# Altium schematic sheet Power.SchDoc
size A3
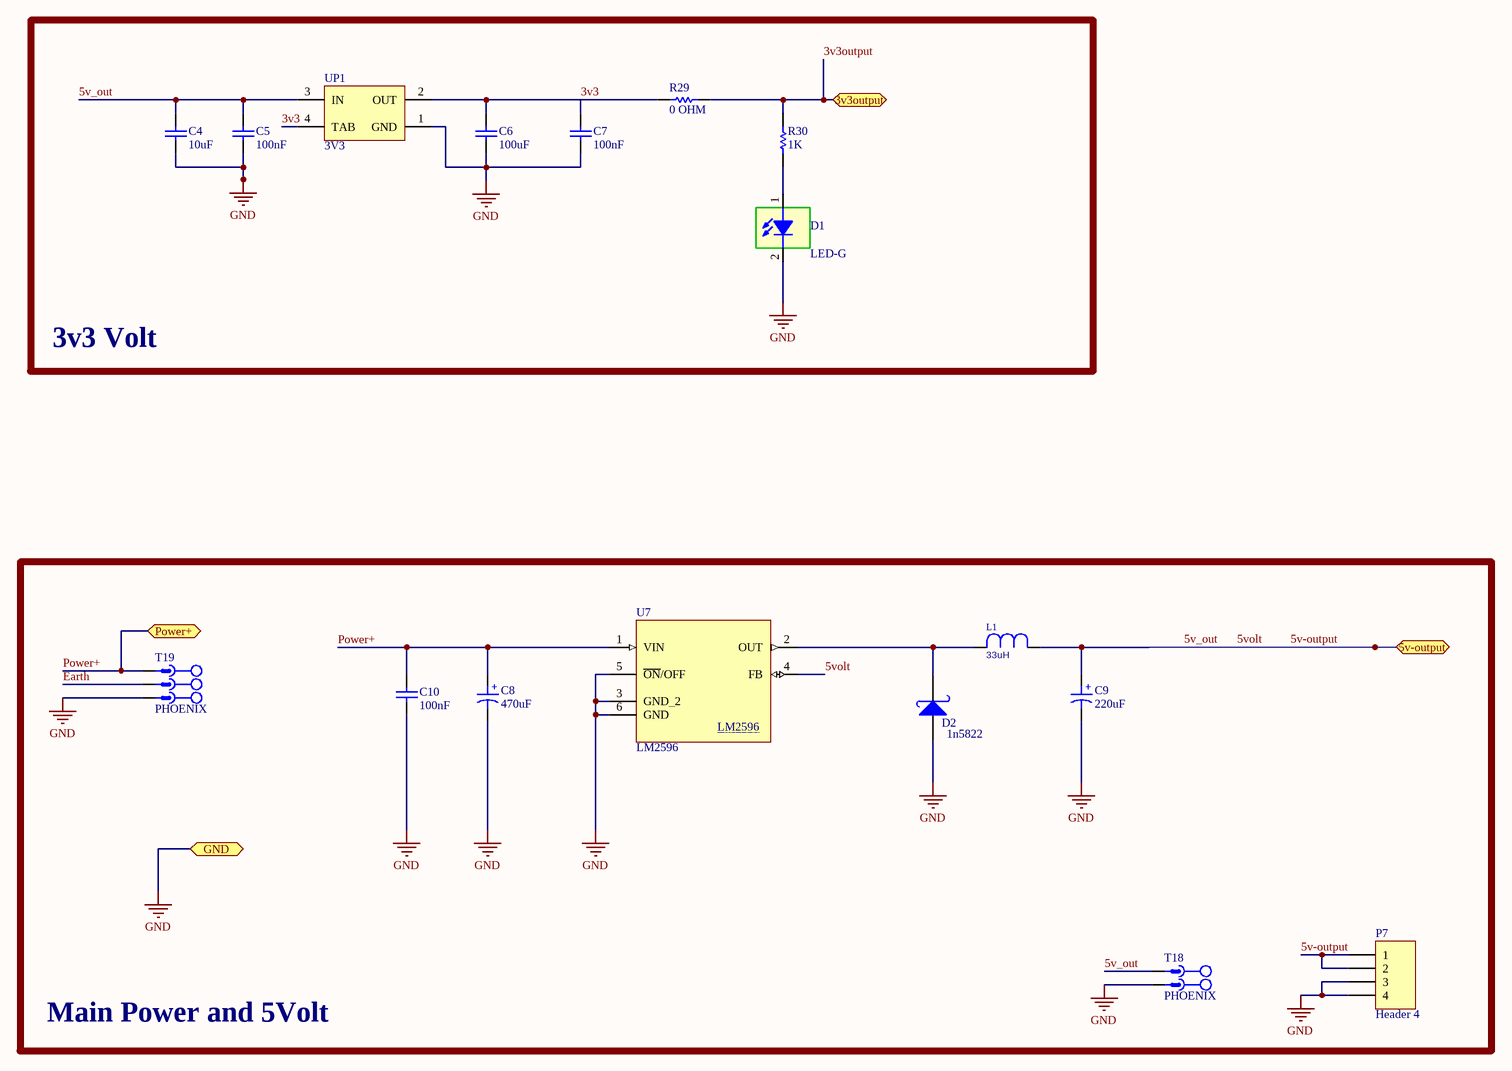
[diagram p0: Power.SchDoc]

## Parts
C4  10uF  [CAPC4817X12N]
C5  100nF  [CAPC3413X12N]
C6  100uF  [CAPC4817X12N]
C7  100nF  [CAPC3413X12N]
C8  470uF  [CAP SMD 470uF]
C9  220uF  [CAP SMD 470uF]
C10  100nF  [CAPC3413X12N]
D1  LED-G  [LED 1206]
D2  1n5822  [DO-214AB(SMC)]
L1  33uH  [CDRH127]
P7  Header 4  [HDR1X4]
R29  0 OHM  [RESC3413X04N]
R30  1K  [RESC3413X04N]
T18  PHOENIX  [MSTB 2,5/2-G-5,08]
T19  PHOENIX  [MSTB 2,5/3-G-5,08]
U7  LM2596  [TO170P1524X483-6N]
UP1  3V3  [SOT223_N]

## Blocks framed on the sheet
3v3 Volt: C4-C7 D1 R29 R30 UP1
Main Power and 5Volt: C8-C10 D2 L1 P7 T18 T19 U7

## Ports
3v3output (bidir), 5v-output (bidir), GND (bidir), Power+ (bidir)

## Nets
GND: C4.1 C5.1 C6.1 C7.1 C8.2 C9.2 C10.1 D1.2 D2.1(A) P7.3 P7.4 T18.1 T19.3 U7.3(GND_2) U7.5(~{ON}/OFF) U7.6(GND) UP1.1(GND) ; port GND
3v3: C6.2 C7.2 R29.1 UP1.2(OUT) UP1.4(TAB)
3v3output: R29.2 R30.2 ; port 3v3output
5v-output: C4.2 C5.2 C9.1 L1.1 P7.1 P7.2 T18.2 U7.4(FB) UP1.3(IN) ; port 5v-output  [also labelled 5v_out, 5volt]
Earth: T19.2
Power+: C8.1 C10.2 T19.1 U7.1(VIN) ; port Power+
NetD1_1: D1.1 R30.1
NetD2_2: D2.2(K) L1.2 U7.2(OUT)

## Notes on the sheet
- (in symbol Cap ELECTROLITIC TOTAL SIZE) +

## Library data of the parts
C4 C6 = CAP SMD 1206: CAP 1206; Designer: Abbas Basereh; Desc.: CAP SMD 1206; Data: 16-12-2016
C5 C7 C10 = CAP SMD 0805: CAP 0805; Designer: Abbas Basereh; Desc.: CAP SMD 0805; Data: 16-12-2016
C8 = Cap ELECTROLITIC TOTAL SIZE: Cap electrolitic radial; Designer: Abbas Basereh; Data: 16-12-2016; Part. No: *; VALUE: 470uF
C9 = Cap ELECTROLITIC TOTAL SIZE: Cap electrolitic radial; Designer: Abbas Basereh; VALUE: 1uF; Data: 16-12-2016; Part. No: *
D1 = LED SMD 1206: SMD 1206 LED
D2 = 1N5822 SMD: Schottky Rectifiers; Part. No: SS34; Manufacturer: ON Semiconductor/Fairchild; Designer: Abbas Basereh; Link: https://www.aliexpress.com/item/Free-shipping-100pcs-1n5822-sma-smd-do-214ac-Schottky-diode-ss34/32337482329.html?spm=2114.01010208.3.1.zLZDsP&ws_ab_test=searchweb0_0,searchweb201602_4_10065_10068_10084_10083_10080_10082_10081_10060_10061_10062_10056_10055_10054_10059_10099_10078_10079_427_10073_10103_10102_10096_10052_10050_10051,searchweb201603_4&btsid=6e50dc92-ac69-45bc-a19e-209af19ce602; Link: http://www.tme.eu/en/details/ss34/smd-schottky-diodes/vishay/ss34-e357t/; Link: http://www.digikey.com/product-detail/en/on-semiconductor-fairchild/SS34/SS34FSCT-ND/2094459; Data: 16-12-2016
L1 = L_CDRH127: Inductor; Value: 33uH
P7 = Header 4: Header, 4-Pin; LatestRevisionDate: 17-Jul-2002; LatestRevisionNote: Re-released for DXP Platform.; Publisher: Altium Limited
R29 R30 = RES 0805 0.125W: RES 0805; Designer: Abbas Basereh; Desc.: RES SMD 0805; Data: 16-12-2016
T18 = CON_Phoenix_MSTB_02: 2 Pitch: 5.08 mm Color: green Contact surface: Tin Assembly; Manufacturer: PHOENIX CONTACT; Connector type: PCB Terminal Block; designer: ABBAS BASEREH; Max Current: 12 A; Positions: 2; Voltage: 320 V; Category: Connector; ComponentLink1Description: Header, Nominal current: 12 A Rated voltage (III/2): 320 V Number of positions: 2 Pitch: 5.08 mm Color: green Contact surface: Tin Assembly: Soldering  DESIGNER:ABBAS BASEREH; ComponentLink2Description: Reference; Mounting Technology: Through-Hole; Pin Count: 2; Revision 1: 2017-3-1; Status: Unreleased; PART.NO: PHOENIX
T19 = CON_Phoenix_MSTB_03: 3 Pitch: 5.08 mm Color: green Contact surface: Tin Assembly; Manufacturer: PHOENIX CONTACT; Connector type: PCB Terminal Block; designer: ABBAS BASEREH; Max Current: 12 A; Positions: 3; Voltage: 320 V; Category: Connector; ComponentLink1Description: Header, Nominal current: 12 A Rated voltage (III/2): 320 V Number of positions: 3 Pitch: 5.08 mm Color: green Contact surface: Tin Assembly: Soldering  DESIGNER:ABBAS BASEREH; ComponentLink2Description: Reference; Mounting Technology: Through-Hole; Pin Count: 3; Revision 1: 2017-3-1; Status: Unreleased; PART.NO: PHOENIX
UP1 = AMS1117-x.x: x.x Volt, 800mA Low-Dropout Linear Regulator, 4-pin SOT-223; Designer: Ali Hafizi; Data: 16-12-2016